# Altium schematic sheet LAN8670 Watson.SchDoc
size B; CompanyName: Microchip Technology Inc.; Organization: Microchip Technology; Address1: 2355 West Chandler Blvd.; Address2: Chandler, AZ  85224; Address4: USA; DocumentNumber: 3; SheetNumber: 3; SheetTotal: 5; SheetTitle: LAN8670; Time: Time
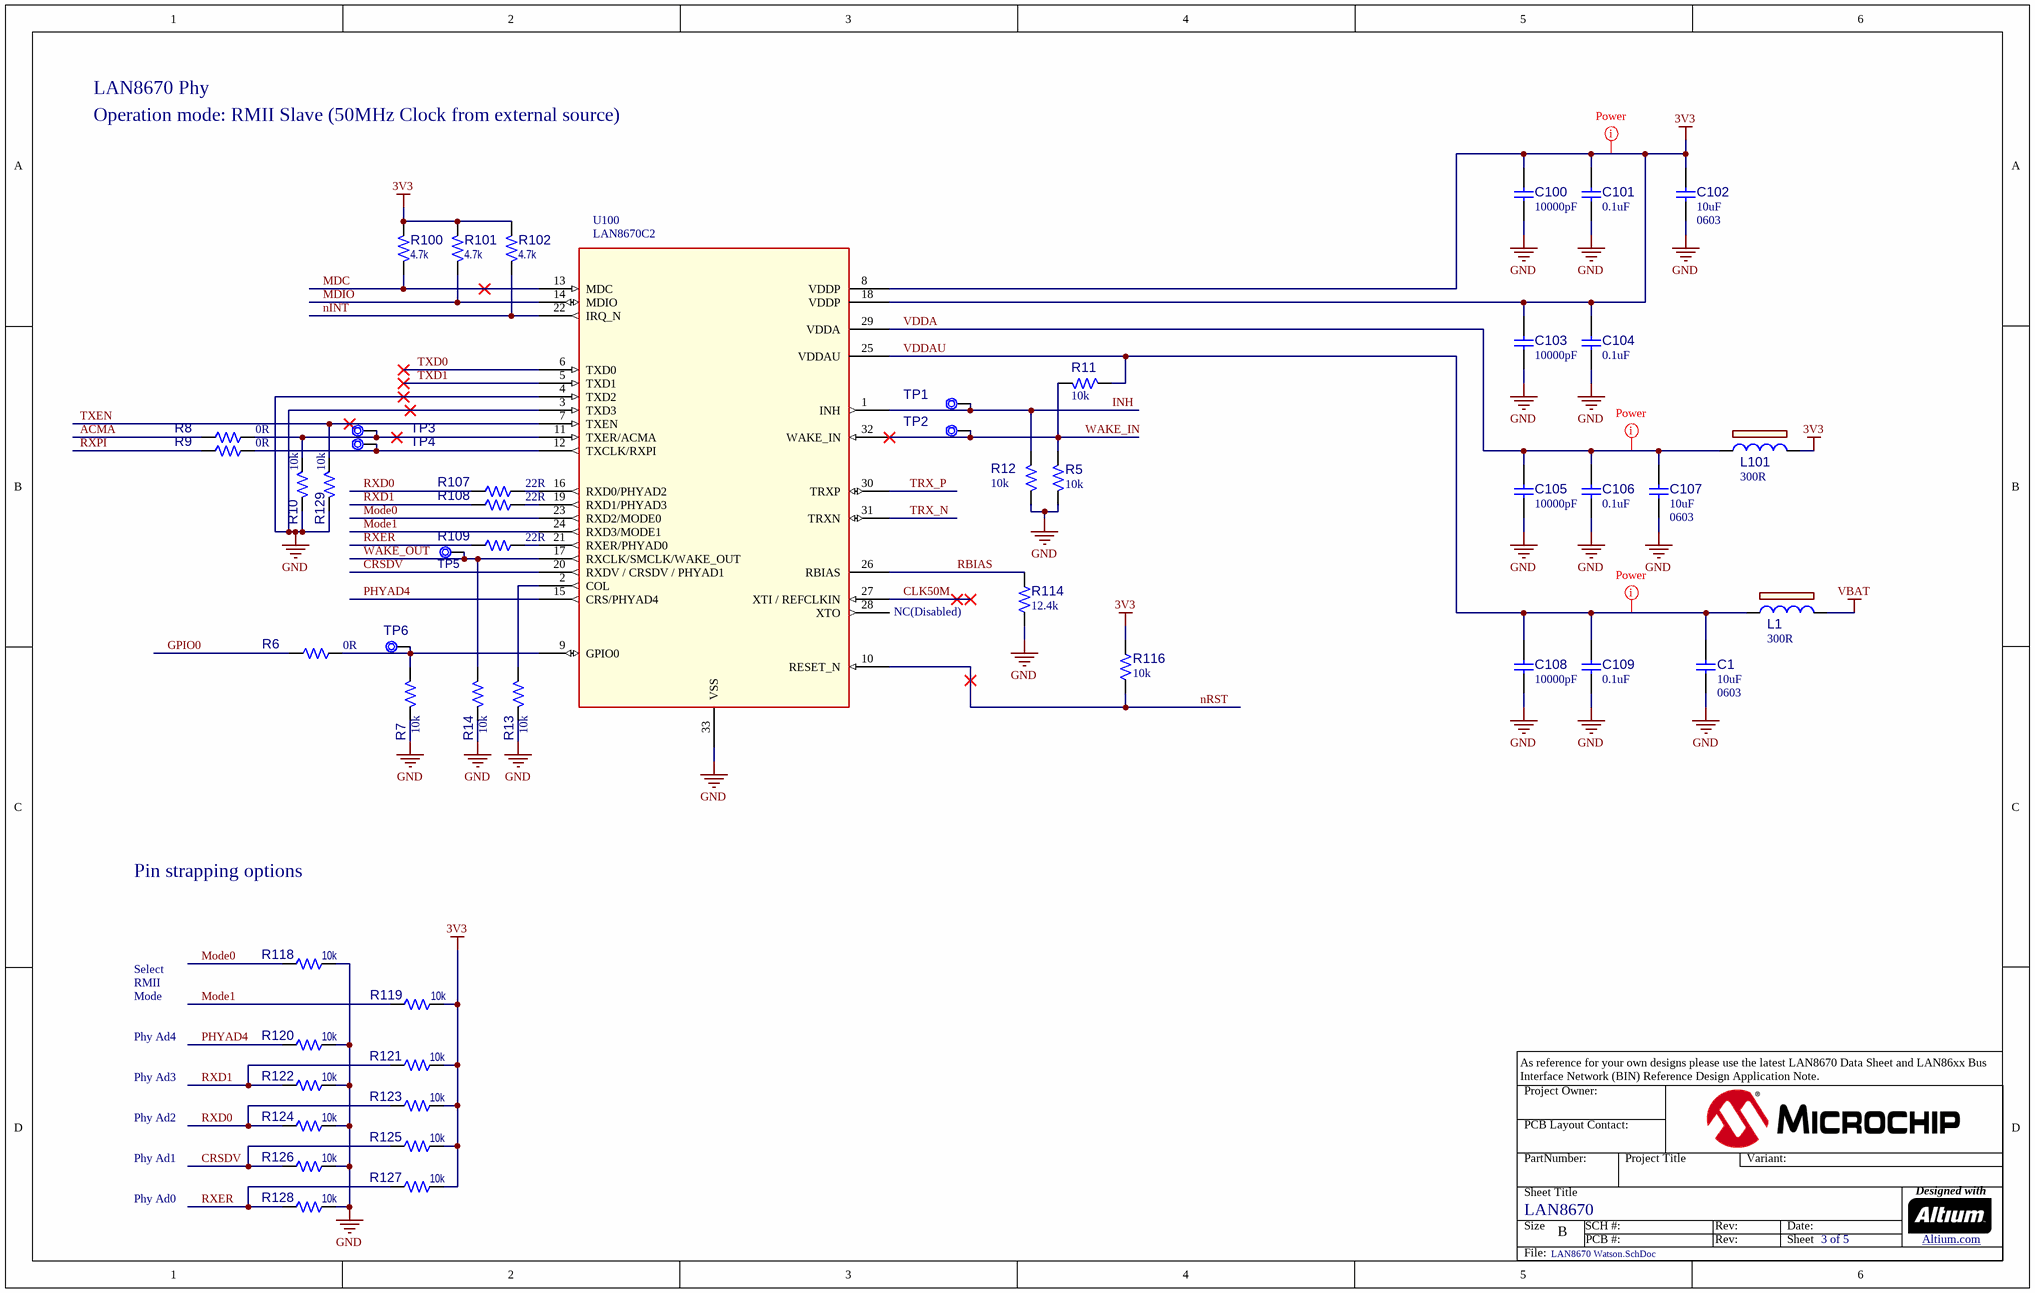
[diagram p0: LAN8670 Watson.SchDoc]

## Parts
C1  value 10uF  Package: 0603  [CAP_C_0603]  (hidden comment: Capacitor NP)
C100  value 10000pF  [CAP_C_0402]  (hidden comment: Capacitor NP)
C101  value 0.1uF  [CAP_C_0402]  (hidden comment: Capacitor NP)
C102  value 10uF  Package: 0603  [CAP_C_0603]  (hidden comment: Capacitor NP)
C103  value 10000pF  [CAP_C_0402]  (hidden comment: Capacitor NP)
C104  value 0.1uF  [CAP_C_0402]  (hidden comment: Capacitor NP)
C105  value 10000pF  [CAP_C_0402]  (hidden comment: Capacitor NP)
C106  value 0.1uF  [CAP_C_0402]  (hidden comment: Capacitor NP)
C107  value 10uF  Package: 0603  [CAP_C_0603]  (hidden comment: Capacitor NP)
C108  value 10000pF  [CAP_C_0402]  (hidden comment: Capacitor NP)
C109  value 0.1uF  [CAP_C_0402]  (hidden comment: Capacitor NP)
L1  value 300R  [IND_C_0603]  (hidden comment: Ferrite Bead)
L101  value 300R  [IND_C_0603]  (hidden comment: Ferrite Bead)
R5  value 10k  [RES_C_0402]  (hidden comment: Resistor)
R6  value 0R  [RES_C_0402]  (hidden comment: Resistor)
R7  value 10k  [RES_C_0402]  (hidden comment: Resistor)
R8  value 0R  [RES_C_0402]
R9  value 0R  [RES_C_0402]  (hidden comment: Resistor)
R10  value 10k  [RES_C_0402]  (hidden comment: Resistor)
R11  value 10k  [RES_C_0402]  (hidden comment: Resistor)
R12  value 10k  [RES_C_0402]  (hidden comment: Resistor)
R13  value 10k  [RES_C_0402]  (hidden comment: Resistor)
R14  value 10k  [RES_C_0402]  (hidden comment: Resistor)
R100  value 4.7k  [RES_C_0402]  (hidden comment: Resistor)
R101  value 4.7k  [RES_C_0402]  (hidden comment: Resistor)
R102  value 4.7k  [RES_C_0402]  (hidden comment: Resistor)
R107  value 22R  [RES_C_0402]  (hidden comment: Resistor)
R108  value 22R  [RES_C_0402]  (hidden comment: Resistor)
R109  value 22R  [RES_C_0402]  (hidden comment: Resistor)
R114  value 12.4k  [RES_C_0402]  (hidden comment: Resistor)
R116  value 10k  [RES_C_0402]  (hidden comment: Resistor)
R118  value 10k  [RES_C_0402]  (hidden comment: Resistor)
R119  value 10k  [RES_C_0402]  (hidden comment: Resistor)
R120  value 10k  [RES_C_0402]  (hidden comment: Resistor)
R121  value 10k  [RES_C_0402]  (hidden comment: Resistor)
R122  value 10k  [RES_C_0402]  (hidden comment: Resistor)
R123  value 10k  [RES_C_0402]  (hidden comment: Resistor)
R124  value 10k  [RES_C_0402]  (hidden comment: Resistor)
R125  value 10k  [RES_C_0402]  (hidden comment: Resistor)
R126  value 10k  [RES_C_0402]  (hidden comment: Resistor)
R127  value 10k  [RES_C_0402]  (hidden comment: Resistor)
R128  value 10k  [RES_C_0402]  (hidden comment: Resistor)
R129  value 10k  [RES_C_0402]  (hidden comment: Resistor)
TP1  Test Point No BOM  [TP_rd_0.5mm]  (value not drawn)  (no BOM)
TP2  Test Point No BOM  [TP_rd_0.5mm]  (value not drawn)  (no BOM)
TP3  Test Point No BOM  [TP_rd_0.5mm]  (value not drawn)  (no BOM)
TP4  Test Point No BOM  [TP_rd_0.5mm]  (value not drawn)  (no BOM)
TP5  Test Point No BOM  [TP_rd_0.5mm]  (value not drawn)  (no BOM)
TP6  Test Point No BOM  [TP_rd_0.5mm]  (value not drawn)  (no BOM)
U100  value LAN8670C2  [VQFN-32_5x5_EP3.3x3.3]  (hidden comment: LAN8670C VQFN-32)

## Nets
3V3: C100.2 C101.2 C102.2 C103.2 C104.2 L101.2 R100.2 R101.2 R102.2 R116.2 R119.2 R121.2 R123.2 R125.2 R127.2 U100.8(VDDP) U100.18(VDDP)
GND: C1.1 C100.1 C101.1 C102.1 C103.1 C104.1 C105.1 C106.1 C107.1 C108.1 C109.1 R5.1 R7.1 R10.1 R12.1 R13.1 R14.1 R114.1 R118.2 R120.2 R122.2 R124.2 R126.2 R128.2 R129.1 U100.3(TXD3) U100.4(TXD2) U100.33(VSS)
VBAT: L1.2
ACMA: R8.1
CLK50M: U100.27(XTI_/_REFCLKIN)
CRSDV: R125.1 R126.1 U100.20(RXDV_/_CRSDV_/_PHYAD1)
GPIO0: R6.1
INH: R12.2 TP1.1 U100.1(INH)
MDC: R100.1 U100.13(MDC)
MDIO: R101.1 U100.14(MDIO)
Mode0: R118.1 U100.23(RXD2/MODE0)
Mode1: R119.1 U100.24(RXD3/MODE1)
nINT: R102.1 U100.22(IRQ_N)
nRST: R116.1 U100.10(RESET_N)
PHYAD4: R120.1 U100.15(CRS/PHYAD4)
RBIAS: R114.2 U100.26(RBIAS)
RXD0: R107.1 R123.1 R124.1
RXD1: R108.1 R121.1 R122.1
RXER: R109.1 R127.1 R128.1
RXPI: R9.1
TRX_N: U100.31(TRXN)
TRX_P: U100.30(TRXP)
TXD0: U100.6(TXD0)
TXD1: U100.5(TXD1)
TXEN: R129.2 U100.7(TXEN)
VDDA: C105.2 C106.2 C107.2 L101.1 U100.29(VDDA)
VDDAU: C1.2 C108.2 C109.2 L1.1 R11.1 U100.25(VDDAU)
WAKE_IN: R5.2 R11.2 TP2.1 U100.32(WAKE_IN)
WAKE_OUT: R14.2 TP5.1 U100.17(RXCLK/SMCLK/WAKE_OUT)
NetR6_2: R6.2 R7.2 TP6.1 U100.9(GPIO0)
NetR8_2: R8.2 R10.2 TP3.1 U100.11(TXER/ACMA)
NetR9_2: R9.2 TP4.1 U100.12(TXCLK/RXPI)
NetR13_2: R13.2 U100.2(COL)
NetR107_2: R107.2 U100.16(RXD0/PHYAD2)
NetR108_2: R108.2 U100.19(RXD1/PHYAD3)
NetR109_2: R109.2 U100.21(RXER/PHYAD0)

Not connected (* = marked no-connect by the designer): U100 28(XTO)

## Layout directives
net class Power: 3V3, VDDA, VDDAU

## Notes on the sheet
- LAN8670 Phy
- Operation mode: RMII Slave (50MHz Clock from external source)
- NC(Disabled)
- Pin strapping options
- Select
- RMII
- Mode
- Phy Ad4
- Phy Ad3
- As reference for your own designs please use the latest LAN8670 Data Sheet and LAN86xx Bus Interface Network (BIN) Reference Design Application Note.
- Phy Ad2
- Phy Ad1
- Phy Ad0
- Project Owner:
- PCB Layout Contact:
- PartNumber:
- Project Title
- Variant:
- Sheet Title
- Size
- B
- SCH #:
- PCB #:
- Rev:
- Date:
- Sheet
- Designed with
- Altium.com <http://go.altium.com/MicrochipLandingPage_Evaluation.html>
- File:

## Library data of the parts
C1 = CAP0542: Manufacturer 1: Samsung; Manufacturer Part Number 1: CL10A106MP8NNNC; Voltage: 10V; Description_: CAP CER 10uF 10V 20% X5R SMD 0603; Dev Tools Status: Production; Tolerance: 20%; Type: Ceramic; Populated: Yes; Temperature Coefficient: X5R; MCHP-ID: CAP0542; Revision: 2; Symbol: Capacitor NP; Status: MCL Design; ComponentLink1URL: https://chn-vm-apps.microchip.com/mchprepo/parts/Datasheets/ECJ__General_.pdf; ComponentLink1Description: SVN Datasheet; ComponentLink2URL: C:\ALTIUM_WORK\00001_MCHP-CDB\Datasheets\ECJ__General_.pdf; ComponentLink2Description: Local Datasheet; ComponentLink3URL: C:\ALTIUM_WORK\00001_MCHP-CDB\Library\LibraryRefs\Capacitor NP.SchLib; ComponentLink3Description: Open Symbol; ComponentLink4URL: C:\ALTIUM_WORK\00001_MCHP-CDB\Library\Footprints\CAP_C_0603.PcbLib; ComponentLink4Description: Open Footprint; ComponentLink5Description: Open Footprint 2; ComponentLink6Description: Open Footprint 3; ComponentLink7Description: Open Footprint 4; Operating Temperature: -55C to +85C; Category: Capacitor; Manufacturer 2: TDK Corporation; Manufacturer Part Number 2: C1608X5R1A106M; Manufacturer 3: Panasonic; Manufacturer Part Number 3: ECJ-1VB1A106M; Supplier 1: Digi-Key; Supplier Part Number 1: 1276-1871-1-ND; Supplier 2: Digi-Key; Supplier Part Number 2: 445-6853-1-ND; Supplier 3: Digi-Key; Supplier Part Number 3: PCC2479CT-ND; Quantity Override: 1
C100 C103 C105 C108 = CAP2026: Manufacturer 1: Murata Electronics North America; Manufacturer Part Number 1: GCM155R71H103KA55D; Voltage: 50V; Tolerance: 10%; Description_: CAP CER 10000pF 50V 10% X7R SMD 0402 AEC-Q200; Temperature Coeffcient: X7R; Type: Ceramic; Owner: Gabor Bihari; Populated: YES; Dev Tools Status: Production; MCHP-ID: CAP2026; Revision: 1; Status: MCL Design; Package: 0402; Operating Temperature: -55C to +125C; Category: Capacitor; Supplier 1: Digi-Key; Supplier Part Number 1: 490-4762-1-ND; Quantity Override: 1; Symbol: Capacitor NP; ComponentLink1URL: https://chn-vm-apps.microchip.com/mchprepo/parts/Datasheets/mlcc_automotive_general_en.pdf; ComponentLink1Description: SVN Datasheet; ComponentLink2URL: C:\ALTIUM_WORK\00001_MCHP-CDB\Datasheets\mlcc_automotive_general_en.pdf; ComponentLink2Description: Local Datasheet; ComponentLink3URL: C:\ALTIUM_WORK\00001_MCHP-CDB\Library\LibraryRefs\Capacitor NP.SchLib; ComponentLink3Description: Open Symbol; ComponentLink4URL: C:\ALTIUM_WORK\00001_MCHP-CDB\Library\Footprints\CAP_C_0402.PcbLib; ComponentLink4Description: Open Footprint; ComponentLink5Description: Open Footprint 2; ComponentLink6Description: Open Footprint 3; ComponentLink7Description: Open Footprint 4; Manufacturer 2: TDK Corporation; Manufacturer Part Number 2: CGA2B3X7R1H103K050BB; Supplier 2: Digi-Key; Supplier Part Number 2: 445-6893-1-ND
C101 C104 C106 C109 = CAP1033: Capacitor; Manufacturer 1: Murata; Manufacturer Part Number 1: GRM155R71C104KA88D; Voltage: 16V; Description_: CAP CER 0.1uF 16V 10% X7R SMD 0402; Tolerance: 10%; Temperature Coeffcient: X7R; Type: Ceramic; Owner: Sompoch Loboonlert; Populated: Yes; MCHP-ID: CAP1033; Package: 0402; Revision: 2; Status: Production; ComponentLink1URL: https://chn-vm-apps.microchip.com/mchprepo/parts/Datasheets/L0005E.pdf; ComponentLink1Description: Datasheet; Operating Temperature: -55C to +125C; Category: Capacitor; Supplier 1: Digi-Key; Supplier Part Number 1: 490-3261-2-ND; Quantity Override: 1
C102 C107 = CAP0542: Capacitor; Manufacturer 1: Samsung; Manufacturer Part Number 1: CL10A106MP8NNNC; Voltage: 10V; Description_: CAP CER 10uF 10V 20% X5R SMD 0603; Dev Tools Status: Production; Tolerance: 20%; Temperature Coeffcient: X5R; Type: Ceramic; Populated: Yes; MCHP-ID: CAP0542; Revision: 2; Symbol: Capacitor NP; Status: MCL Design; ComponentLink1URL: https://chn-vm-apps.microchip.com/mchprepo/parts/Datasheets/ECJ__General_.pdf; ComponentLink1Description: SVN Datasheet; ComponentLink2URL: C:\ALTIUM_WORK\00001_MCHP-CDB\Datasheets\ECJ__General_.pdf; ComponentLink2Description: Local Datasheet; ComponentLink3URL: C:\ALTIUM_WORK\00001_MCHP-CDB\Library\LibraryRefs\Capacitor NP.SchLib; ComponentLink3Description: Open Symbol; ComponentLink4URL: C:\ALTIUM_WORK\00001_MCHP-CDB\Library\Footprints\CAP_C_0603.PcbLib; ComponentLink4Description: Open Footprint; ComponentLink5Description: Open Footprint 2; ComponentLink6Description: Open Footprint 3; ComponentLink7Description: Open Footprint 4; Operating Temperature: -55C to +85C; Category: Capacitor; Manufacturer 2: TDK Corporation; Manufacturer Part Number 2: C1608X5R1A106M; Manufacturer 3: Panasonic; Manufacturer Part Number 3: ECJ-1VB1A106M; Supplier 1: Digi-Key; Supplier Part Number 1: 1276-1871-1-ND; Supplier 2: Digi-Key; Supplier Part Number 2: 445-6853-1-ND; Supplier 3: Digi-Key; Supplier Part Number 3: PCC2479CT-ND; Quantity Override: 1
L1 L101 = IND1886: Manufacturer 1: WURTH ELEKTRONIK; Manufacturer Part Number 1: 742792640; Description_: FERRITE BEAD 300Ohms@100MHz 300mA SMD 0603; Owner: Lori Graham; Populated: YES; Dev Tools Status: Design; DCR: 350mOhm; RMS Current: 300mA; Test Frequency: 100 MHz; MCHP-ID: IND1886; Revision: 1; Status: MCL Design; Type: Ferrite Bead; Category: Inductor; Supplier 1: Digi-Key; Supplier Part Number 1: 732-1578-1-ND; Quantity Override: 1; Symbol: Ferrite Bead; ComponentLink1URL: https://chn-vm-apps.microchip.com/mchprepo/parts/Datasheets/Wurth_742792640; ComponentLink1Description: SVN Datasheet; ComponentLink2URL: C:\ALTIUM_WORK\00001_MCHP-CDB\Datasheets\Wurth_742792640; ComponentLink2Description: Local Datasheet; ComponentLink3URL: C:\ALTIUM_WORK\00001_MCHP-CDB\Library\LibraryRefs\Ferrite Bead.SchLib; ComponentLink3Description: Open Symbol; ComponentLink4URL: C:\ALTIUM_WORK\00001_MCHP-CDB\Library\Footprints\IND_C_0603.PcbLib; ComponentLink4Description: Open Footprint; ComponentLink5Description: Open Footprint 2; ComponentLink6Description: Open Footprint 3; ComponentLink7Description: Open Footprint 4; Operating Temperature: -55°C ~ 125°C; Package: 0603
R5 = RSMT1019: Manufacturer 1: Panasonic; Manufacturer Part Number 1: ERJ-2RKF1002X; Description_: RES TKF 10k 1% 1/10W SMD 0402; Voltage: 50V; Power: 1/10W; Populated: Yes; Dev Tools Status: Production; Tolerance: 1%; Owner: Brent Lanphear; Temperature Coefficient: 100ppm/C; MCHP-ID: RSMT1019; Revision: 2; Status: MCL Design; ComponentLink1URL: https://chn-vm-apps.microchip.com/mchprepo/parts/Datasheets/AOA0000CE2.pdf; ComponentLink1Description: SVN Datasheet; Operating Temperature: -55C to +155C; Category: Resistor; Type: RES SMD; Composition: TKF; Supplier 1: Digi-Key; Supplier Part Number 1: P10.0KLCT-ND; Quantity Override: 1; Package: 0402; Symbol: Resistor; ComponentLink2URL: C:\ALTIUM_WORK\00001_MCHP-CDB\Datasheets\AOA0000CE2.pdf; ComponentLink2Description: Local Datasheet; ComponentLink3URL: C:\ALTIUM_WORK\00001_MCHP-CDB\Library\LibraryRefs\Resistor.SchLib; ComponentLink3Description: Open Symbol; ComponentLink4URL: C:\ALTIUM_WORK\00001_MCHP-CDB\Library\Footprints\RES_C_0402.PcbLib; ComponentLink4Description: Open Footprint; ComponentLink5Description: Open Footprint 2; ComponentLink6Description: Open Footprint 3; ComponentLink7Description: Open Footprint 4
R6 R9 = RSMT1246: Manufacturer 1: Panasonic Electronic Components; Manufacturer Part Number 1: ERJ-2GE0R00X; Description_: RES TKF 0R 1/10W SMD 0402; Tolerance: 50mOhm; Power: 1/10W; Owner: Dragos Danaila; Populated: YES; Dev Tools Status: Production; Voltage: 50V; Current: 1A; MCHP-ID: RSMT1246; Revision: 1; Status: MCL Design; Package: 0402; Operating Temperature: -55C to +155C; Category: Resistor; Type: RES SMD; Composition: TKF; Supplier 1: Digi-Key; Supplier Part Number 1: P0.0JCT-ND; Quantity Override: 1; Symbol: Resistor; ComponentLink1URL: https://chn-vm-apps.microchip.com/mchprepo/parts/Datasheets/DMA0000COL9.pdf; ComponentLink1Description: SVN Datasheet; ComponentLink2URL: C:\ALTIUM_WORK\00001_MCHP-CDB\Datasheets\DMA0000COL9.pdf; ComponentLink2Description: Local Datasheet; ComponentLink3URL: C:\ALTIUM_WORK\00001_MCHP-CDB\Library\LibraryRefs\Resistor.SchLib; ComponentLink3Description: Open Symbol; ComponentLink4URL: C:\ALTIUM_WORK\00001_MCHP-CDB\Library\Footprints\RES_C_0402.PcbLib; ComponentLink4Description: Open Footprint; ComponentLink5Description: Open Footprint 2; ComponentLink6Description: Open Footprint 3; ComponentLink7Description: Open Footprint 4
R7 R13 R14 R116 = RSMT1019: Manufacturer 1: Panasonic; Manufacturer Part Number 1: ERJ-2RKF1002X; Tolerance: 1%; Description_: RES TKF 10k 1% 1/10W SMD 0402; Dev Tools Status: Production; Voltage: 50V; Power: 1/10W; Owner: Brent Lanphear; Populated: Yes; Temperature Coefficient: 100ppm/C; MCHP-ID: RSMT1019; Package: 0402; Revision: 2; Symbol: Resistor; Status: MCL Design; ComponentLink1URL: https://chn-vm-apps.microchip.com/mchprepo/parts/Datasheets/AOA0000CE2.pdf; ComponentLink1Description: SVN Datasheet; ComponentLink2URL: C:\ALTIUM_WORK\00001_MCHP-CDB\Datasheets\AOA0000CE2.pdf; ComponentLink2Description: Local Datasheet; ComponentLink3URL: C:\ALTIUM_WORK\00001_MCHP-CDB\Library\LibraryRefs\Resistor.SchLib; ComponentLink3Description: Open Symbol; ComponentLink4URL: C:\ALTIUM_WORK\00001_MCHP-CDB\Library\Footprints\RES_C_0402.PcbLib; ComponentLink4Description: Open Footprint; ComponentLink5Description: Open Footprint 2; ComponentLink6Description: Open Footprint 3; ComponentLink7Description: Open Footprint 4; Operating Temperature: -55C to +155C; Category: Resistor; Type: RES SMD; Composition: TKF; Supplier 1: Digi-Key; Supplier Part Number 1: P10.0KLCT-ND; Quantity Override: 1
R8 = RSMT1246: Resistor; Manufacturer 1: Panasonic Electronic Components; Manufacturer Part Number 1: ERJ-2GE0R00X; Description_: RES TKF 0R 1/10W SMD 0402; Tolerance: 50mOhm; Power: 1/10W; Owner: Dragos Danaila; Populated: YES; Dev Tools Status: Production; Voltage: 50V; Current: 1A; MCHP-ID: RSMT1246; Revision: 1; Status: MCL Design; Package: 0402; Operating Temperature: -55C to +155C; Category: Resistor; Type: RES SMD; Composition: TKF; Supplier 1: Digi-Key; Supplier Part Number 1: P0.0JCT-ND; Quantity Override: 1; Symbol: Resistor; ComponentLink1URL: https://chn-vm-apps.microchip.com/mchprepo/parts/Datasheets/DMA0000COL9.pdf; ComponentLink1Description: SVN Datasheet; ComponentLink2URL: C:\ALTIUM_WORK\00001_MCHP-CDB\Datasheets\DMA0000COL9.pdf; ComponentLink2Description: Local Datasheet; ComponentLink3URL: C:\ALTIUM_WORK\00001_MCHP-CDB\Library\LibraryRefs\Resistor.SchLib; ComponentLink3Description: Open Symbol; ComponentLink4URL: C:\ALTIUM_WORK\00001_MCHP-CDB\Library\Footprints\RES_C_0402.PcbLib; ComponentLink4Description: Open Footprint; ComponentLink5Description: Open Footprint 2; ComponentLink6Description: Open Footprint 3; ComponentLink7Description: Open Footprint 4
R10-R12 R118-R129 = RSMT1019: Manufacturer 1: Panasonic; Manufacturer Part Number 1: ERJ-2RKF1002X; Tolerance: 1%; Description_: RES TKF 10k 1% 1/10W SMD 0402; Dev Tools Status: Production; Voltage: 50V; Temperature Coeffcient: 100ppm/C; Power: 1/10W; Owner: Brent Lanphear; Populated: Yes; MCHP-ID: RSMT1019; Package: 0402; Revision: 2; Symbol: Resistor; Status: MCL Design; ComponentLink1URL: https://chn-vm-apps.microchip.com/mchprepo/parts/Datasheets/AOA0000CE2.pdf; ComponentLink1Description: SVN Datasheet; ComponentLink2URL: C:\ALTIUM_WORK\00001_MCHP-CDB\Datasheets\AOA0000CE2.pdf; ComponentLink2Description: Local Datasheet; ComponentLink3URL: C:\ALTIUM_WORK\00001_MCHP-CDB\Library\LibraryRefs\Resistor.SchLib; ComponentLink3Description: Open Symbol; ComponentLink4URL: C:\ALTIUM_WORK\00001_MCHP-CDB\Library\Footprints\RES_C_0402.PcbLib; ComponentLink4Description: Open Footprint; ComponentLink5Description: Open Footprint 2; ComponentLink6Description: Open Footprint 3; ComponentLink7Description: Open Footprint 4; Operating Temperature: -55C to +155C; Category: Resistor; Type: RES SMD; Composition: TKF; Supplier 1: Digi-Key; Supplier Part Number 1: P10.0KLCT-ND; Quantity Override: 1
R100-R102 = RES1462: Manufacturer 1: KOA Speer; Manufacturer Part Number 1: RK73H1ETTP4701F; Description_: RES TKF 4.7k 1% 1/10W 0402; Voltage: 50V; Temperature Coeffcient: 100ppm/C; Power: 1/10W; Populated: YES; Dev Tools Status: Production; Tolerance: 1%; Circuit Type: Isolated; Owner: Stephen Humberd; MCHP-ID: RES1462; Revision: 1; Status: MCL Design; ComponentLink1URL: https://chn-vm-apps.microchip.com/mchprepo/parts/Datasheets/RK73H.pdf; ComponentLink1Description: SVN Datasheet; Operating Temperature: -55C to +155C; Category: Resistor; Type: RES SMD; Composition: TKF; Supplier 1: Mouser; Supplier Part Number 1: 660-RK73H1ETTP4701F; Quantity Override: 1; Package: 0402; Symbol: Resistor; ComponentLink2URL: C:\ALTIUM_WORK\00001_MCHP-CDB\Datasheets\RK73H.pdf; ComponentLink2Description: Local Datasheet; ComponentLink3URL: C:\ALTIUM_WORK\00001_MCHP-CDB\Library\LibraryRefs\Resistor.SchLib; ComponentLink3Description: Open Symbol; ComponentLink4URL: C:\ALTIUM_WORK\00001_MCHP-CDB\Library\Footprints\RES_C_0402.PcbLib; ComponentLink4Description: Open Footprint; ComponentLink5Description: Open Footprint 2; ComponentLink6Description: Open Footprint 3; ComponentLink7Description: Open Footprint 4
R107-R109 = RES1474: Manufacturer 1: Panasonic Electronic Components; Manufacturer Part Number 1: ERJ-2RKF22R0X; Description_: RES TKF 22R 1% 1/20W SMD 0402; Tolerance: 1%; Temperature Coeffcient: 100ppm/C; Power: 1/10W; Owner: Mike Ragsdale; Populated: YES; Dev Tools Status: Production; Circuit Type: Isolated; MCHP-ID: RES1474; Revision: 1; Status: MCL Design; Package: 0402; Operating Temperature: -55C to +155C; Category: Resistor; Type: RES SMD; Composition: TKF; Supplier 1: Digi-Key; Supplier Part Number 1: P22.0LCT-ND; Quantity Override: 1; Symbol: Resistor; ComponentLink1Description: SVN Datasheet; ComponentLink2Description: Local Datasheet; ComponentLink3URL: C:\ALTIUM_WORK\00001_MCHP-CDB\Library\LibraryRefs\Resistor.SchLib; ComponentLink3Description: Open Symbol; ComponentLink4URL: C:\ALTIUM_WORK\00001_MCHP-CDB\Library\Footprints\RES_C_0402.PcbLib; ComponentLink4Description: Open Footprint; ComponentLink5Description: Open Footprint 2; ComponentLink6Description: Open Footprint 3; ComponentLink7Description: Open Footprint 4
R114 = RES2767: Manufacturer 1: Panasonic Electronic Components; Manufacturer Part Number 1: ERJ-2RKF1242X; Description_: RES TKF 12.4K 1% 1/10W SMD 0402 AEC-Q200; Tolerance: ±1%; Temperature Coeffcient: ±100ppm/°C; Power: 1/10W; Owner: Lori Graham; Populated: YES; Dev Tools Status: Design; Voltage: 100V; MCHP-ID: RES2767; Revision: 1; Status: MCL Design; Package: 0402; Operating Temperature: -55°C to +155°C; Category: Resistor; Type: RES SMD; Supplier 1: Digi-Key; Supplier Part Number 1: P12.4KLCT-ND; Quantity Override: 1; Symbol: Resistor; ComponentLink1URL: https://chn-vm-apps.microchip.com/mchprepo/parts/Datasheets/Panasonic_RES_ERJ_Series; ComponentLink1Description: SVN Datasheet; ComponentLink2URL: C:\ALTIUM_WORK\00001_MCHP-CDB\Datasheets\Panasonic_RES_ERJ_Series; ComponentLink2Description: Local Datasheet; ComponentLink3URL: C:\ALTIUM_WORK\00001_MCHP-CDB\Library\LibraryRefs\Resistor.SchLib; ComponentLink3Description: Open Symbol; ComponentLink4URL: C:\ALTIUM_WORK\00001_MCHP-CDB\Library\Footprints\RES_C_0402.PcbLib; ComponentLink4Description: Open Footprint; ComponentLink5Description: Open Footprint 2; ComponentLink6Description: Open Footprint 3; ComponentLink7Description: Open Footprint 4; Composition: TKF
TP1-TP6 = AIS-CON0024: Test Point; Value: TP PAD RD 0.5mm SMD; Description_: TP Pad PCB round 0.5mm SMD; Owner: JBU  (M21065); Populated: Yes; MCHP-ID: AIS-CON0024; Revision: 1; Type: Test Point; Category: Connector; Quantity Override: 1
U100 = IC2413: Manufacturer 1: Microchip Technology; MCHP-ID: IC2413; Description_: MCHP INTERFACE 10BASE-T1S ETHERNET LAN8670C2 VQFN-32; Owner: Lori Cantrell; Populated: YES; Dev Tools Status: Design; Revision: 1; Status: MCL Design; Type: Ethernet; Category: MCHP-Interface; Manufacturer Part Number 1: LAN8670C2; Supplier 1: Microchip Technology; Supplier Part Number 1: LAN8670C2; Quantity Override: 1; Symbol: LAN8670C VQFN-32; ComponentLink1URL: https://chn-vm-apps.microchip.com/mchprepo/parts/Datasheets/LAN8670_1_2.pdf; ComponentLink1Description: SVN Datasheet; ComponentLink2URL: C:\ALTIUM_WORK\00001_MCHP-CDB\Datasheets\LAN8670_1_2.pdf; ComponentLink2Description: Local Datasheet; ComponentLink3URL: C:\ALTIUM_WORK\00001_MCHP-CDB\Library\LibraryRefs\LAN8670C VQFN-32.SchLib; ComponentLink3Description: Open Symbol; ComponentLink4URL: C:\ALTIUM_WORK\00001_MCHP-CDB\Library\Footprints\VQFN-32_5x5_EP3.3x3.3.PcbLib; ComponentLink4Description: Open Footprint; ComponentLink5Description: Open Footprint 2; ComponentLink6Description: Open Footprint 3; ComponentLink7Description: Open Footprint 4; Operating Temperature: -40C ~ 125C (TA); Restricted Sourcing: Yes